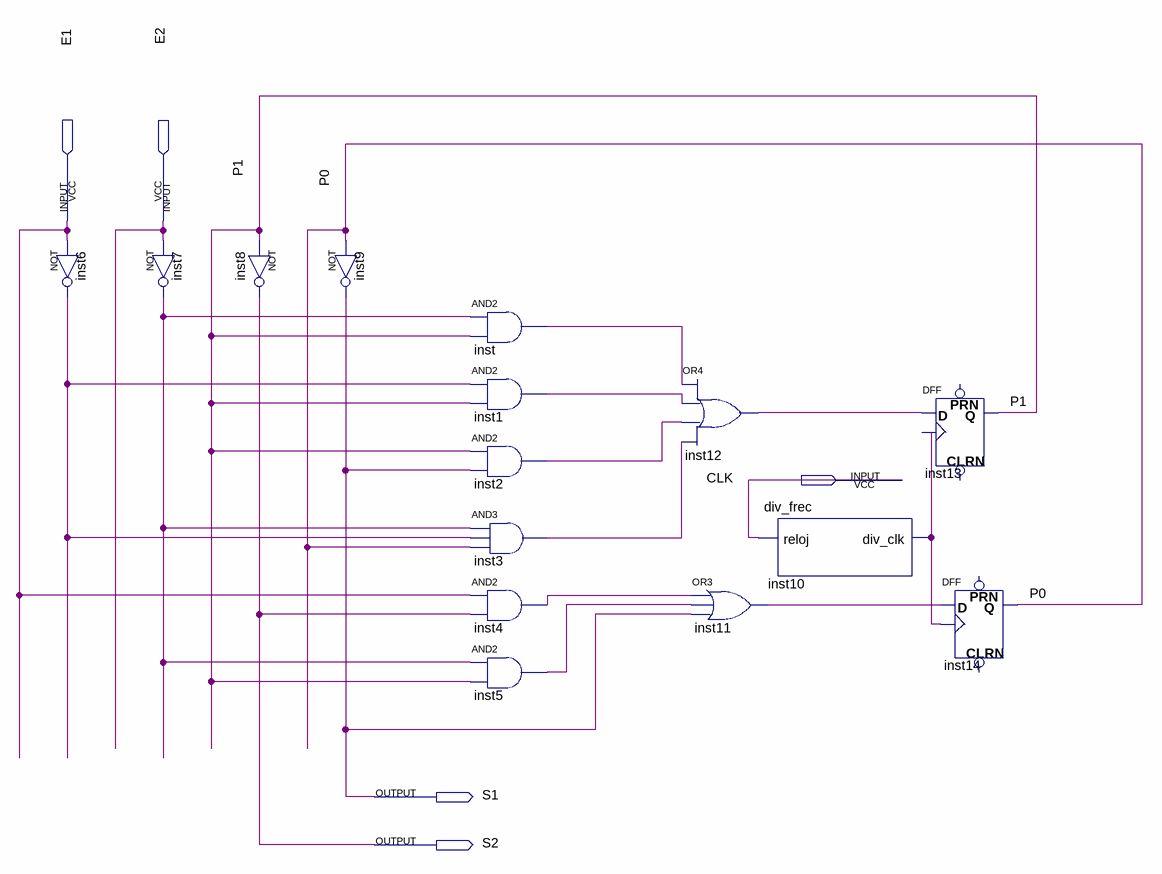
[diagram p0: schematic sheet]
// Quartus schematic Practica2.bdf as structural Verilog: 15 symbols, 5 pins
module Practica2 (
  input  E1,
  input  E2,
  input  CLK,
  output S1,
  output S2
);

  wire inst1_out, inst2_out, inst3_out, inst4_out, inst5_out, inst6_out, inst7_out, inst10_div_clk,
       inst11_out, inst12_out, inst_out, P0, P1;

  not inst6 (inst6_out, E1);
  not inst7 (inst7_out, E2);
  not inst8 (S2, P1);
  not inst9 (S1, P0);
  and inst (inst_out, inst7_out, P1);
  and inst1 (inst1_out, inst6_out, P1);
  and inst2 (inst2_out, P1, S1);
  and inst3 (inst3_out, inst7_out, inst6_out, P0);
  and inst4 (inst4_out, E1, S2);
  and inst5 (inst5_out, inst7_out, P1);
  or inst12 (inst12_out, inst_out, inst1_out, inst2_out, inst3_out);
  or inst11 (inst11_out, inst4_out, inst5_out, S1);
  div_frec inst10 (.reloj(CLK), .div_clk(inst10_div_clk));
  DFF inst13 (.CLK(inst10_div_clk), .D(inst12_out), .Q(P1));  // open: CLRN, PRN
  DFF inst14 (.CLK(inst10_div_clk), .D(inst11_out), .Q(P0));  // open: CLRN, PRN
endmodule
